# Altium schematic sheet _RS_TopLevel.SchDoc
size A4; SheetNumber: 1; SheetTotal: 3
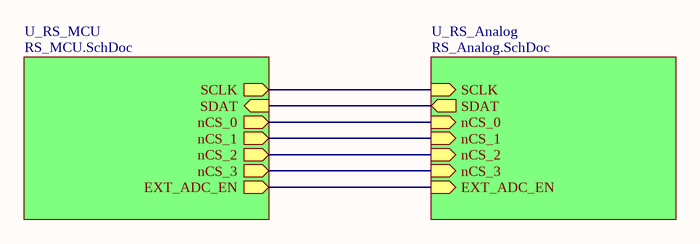
[diagram p0: _RS_TopLevel.SchDoc]

## Sub-sheets
U_RS_Analog = RS_Analog.SchDoc: SDAT (out), SCLK (in), nCS_0 (in), nCS_1 (in), nCS_2 (in), nCS_3 (in), EXT_ADC_EN (in)
U_RS_MCU = RS_MCU.SchDoc: SDAT (in), SCLK (out), nCS_0 (out), nCS_1 (out), nCS_2 (out), nCS_3 (out), EXT_ADC_EN (out)

## Nets
(unnamed): sheet U_RS_MCU/SDAT, sheet U_RS_Analog/SDAT
(unnamed): sheet U_RS_MCU/SCLK, sheet U_RS_Analog/SCLK
(unnamed): sheet U_RS_MCU/nCS_0, sheet U_RS_Analog/nCS_0
(unnamed): sheet U_RS_MCU/nCS_1, sheet U_RS_Analog/nCS_1
(unnamed): sheet U_RS_MCU/nCS_2, sheet U_RS_Analog/nCS_2
(unnamed): sheet U_RS_MCU/nCS_3, sheet U_RS_Analog/nCS_3
(unnamed): sheet U_RS_MCU/EXT_ADC_EN, sheet U_RS_Analog/EXT_ADC_EN